# Altium project PoHalf.PrjPcb
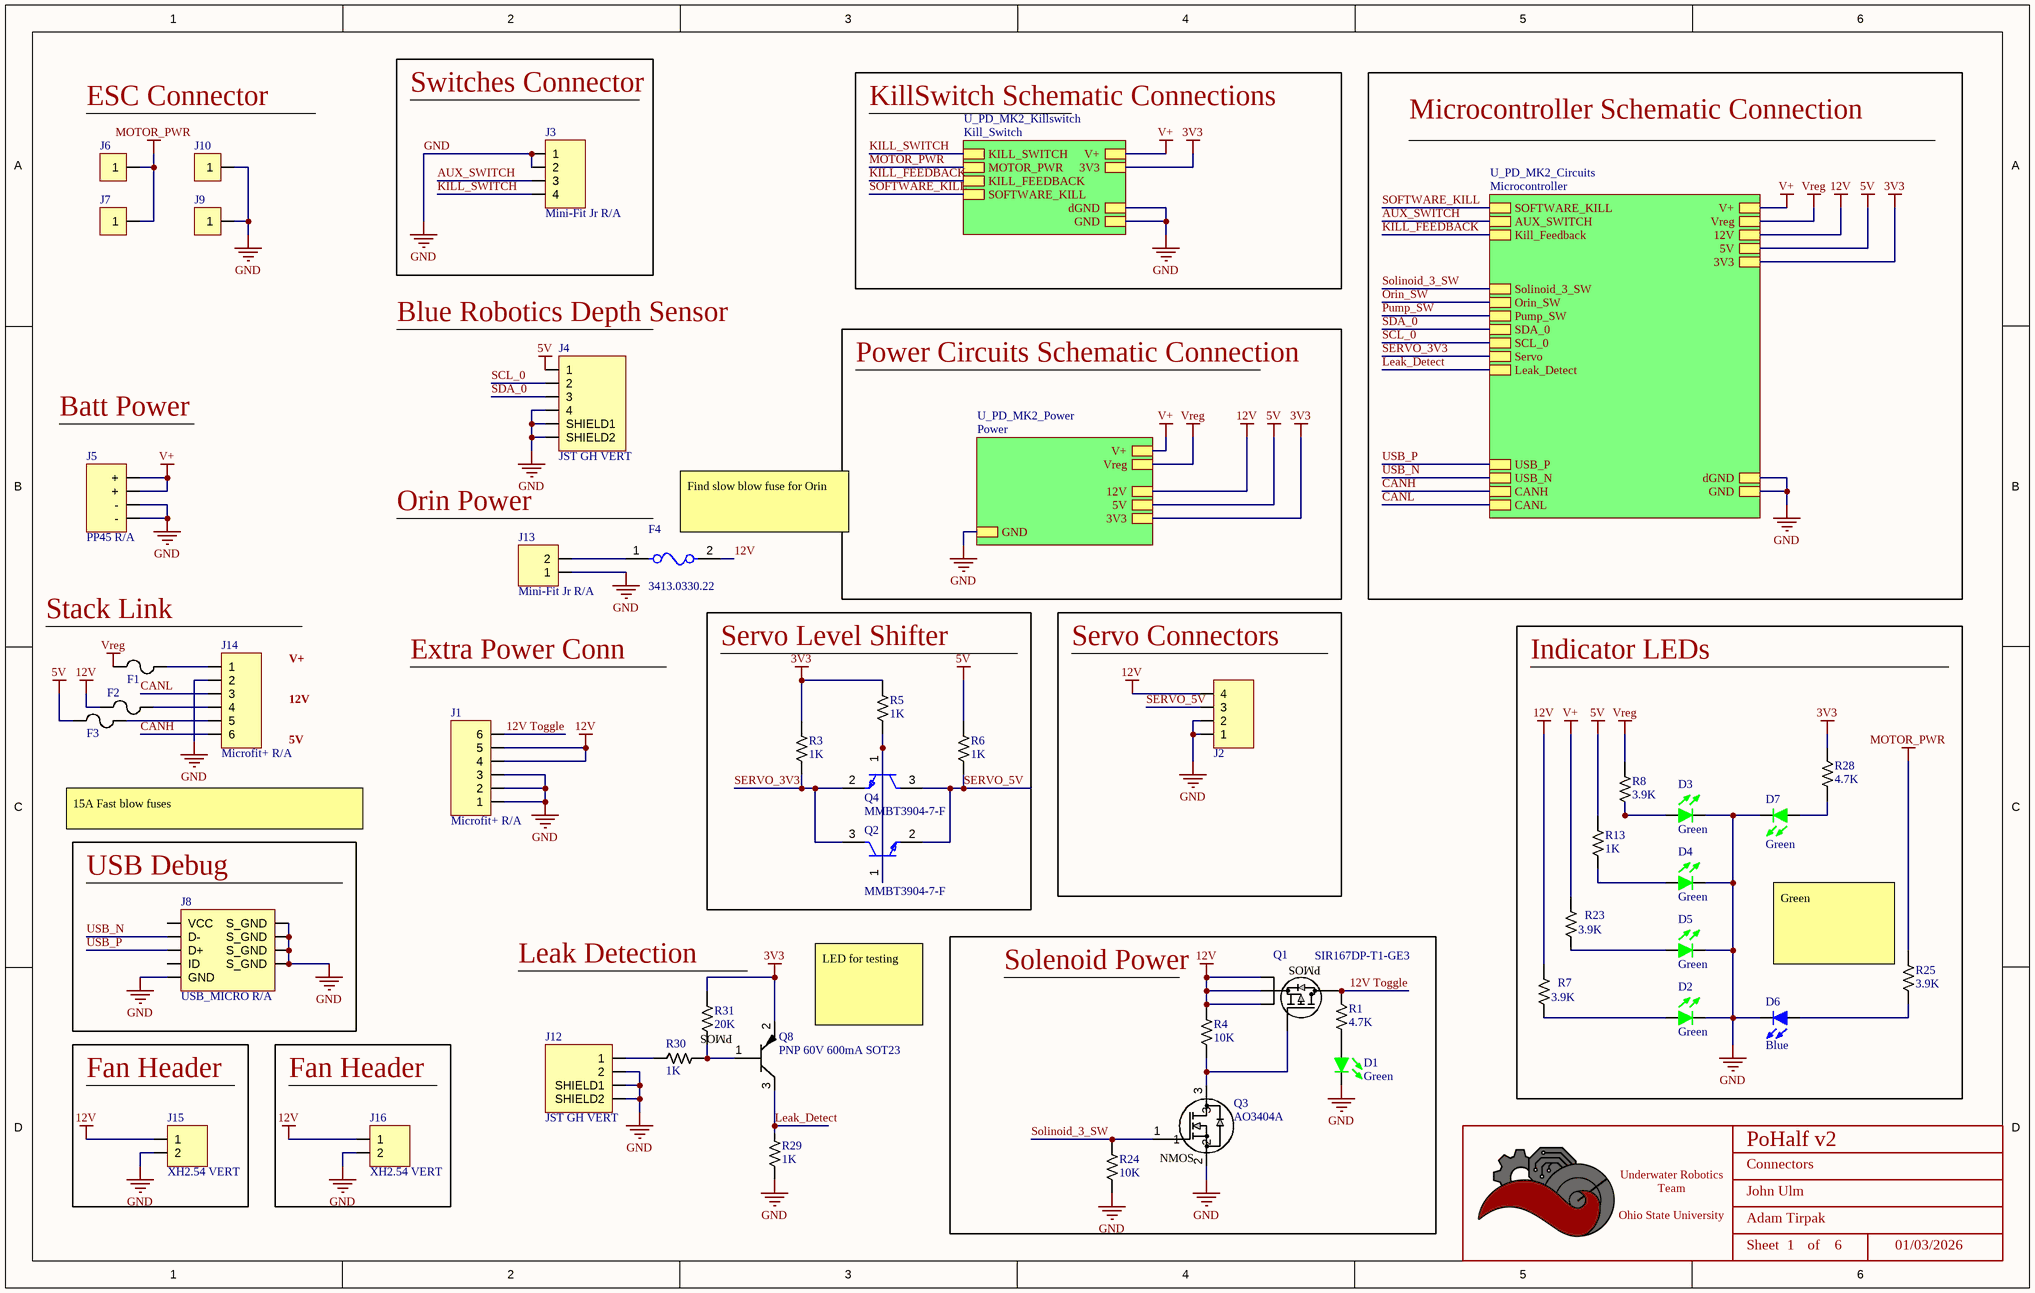
[diagram p0: Connector.SchDoc]
TeamLead: Adam Tirpak; ProjectTitle: PoHalf v2
4 sheets, 95 parts. Net scope: hierarchical (ports join the sheet entries above them; power ports are global).
Board file: PoHalf.PcbDoc
Sheets:
  Connector.SchDoc
    U_PD_MK2_Power = Power.SchDoc
    U_PD_MK2_Circuits = Microcontroller.SchDoc
    U_PD_MK2_Killswitch = Kill_Switch.SchDoc

## Sheet Connector.SchDoc: Connectors
size B; Date: 01/03/2026; Author: John Ulm; Organization: ORGANIZATION; Address1: ADDRESS 1; Address2: ADDRESS 2; Address3: ADDRESS 3; Address4: ADDRESS 4; Revision: -; SheetNumber: 1; SheetTotal: 6; ENG_APP_DATE: --/--/--; DSN_APP_DATE: --/--/--; CHK_APP_DATE: --/--/--

### Parts
(Parts that share a designator on the sheet are numbered #1, #2 ... from top to bottom, then left to right.)
*#1  Title_Block  [LOGO]  (value not drawn)  (graphical)
D1  Color: Green  [LED_0603]  (hidden comment: IN-S63AT5G)
D2  Color: Green  [LED_0603]  (hidden comment: IN-S63AT5G)
D3  Color: Green  [LED_0603]  (hidden comment: IN-S63AT5G)
D4  Color: Green  [LED_0603]  (hidden comment: IN-S63AT5G)
D5  Color: Green  [LED_0603]  (hidden comment: IN-S63AT5G)
D6  Color: Blue  [LED_0603]  (hidden comment: 150060BS75000)
D7  Color: Green  [LED_0603]  (hidden comment: IN-S63AT5G)
F1  0685H9150-01  [0501Series_LTF]  (value not drawn)
F2  0685H9150-01  [0501Series_LTF]  (value not drawn)
F3  0685H9150-01  [0501Series_LTF]  (value not drawn)
F4  3413.0330.22  [FP-3413_0330_22-MFG]
J1  Microfit+ R/A  [CONN_MOLEX_MICROFIT_6_POS_R/A]
J2  Microfit+ R/A  [CONN_MOLEX_MICROFIT_4_POS_R/A]  (value not drawn)
J3  Mini-Fit Jr R/A  [CONN_MOLEX_MINIFIT JR_4 POS_R/A]
J4  JST GH VERT  [CONN_JST_BM04B-GHS-TBT(LF)(SN)(N)]
J5  PP45 R/A  [CONN_ANDERSON_PP45_4 POS_R/A]
J6  Redcube M4 Term 85A  [Redcube M4 Term 85A]  (value not drawn)
J7  Redcube M4 Term 85A  [Redcube M4 Term 85A]  (value not drawn)
J8  USB_MICRO R/A  [CONN_MINIUSB]
J9  Redcube M4 Term 85A  [Redcube M4 Term 85A]  (value not drawn)
J10  Redcube M4 Term 85A  [Redcube M4 Term 85A]  (value not drawn)
J12  JST GH VERT  [CONN_JST_SM02B-GHS-TB(LF)(SN)]
J13  Mini-Fit Jr R/A  [CONN_MOLEX_MINIFIT JR_2 POS_R/A]
J14  Microfit+ R/A  [CONN_MOLEX_MICROFIT_6_POS_R/A]
J15  XH2.54 VERT  [CONN_JST_XH254_2POS_VERT]
J16  XH2.54 VERT  [CONN_JST_XH254_2POS_VERT]
Q1  SIR167DP-T1-GE3  [MOSFET_7DP-T1-GE3_VIS]
Q2  MMBT3904-7-F  [FP-SOT23-IPC_A]
Q3  AO3404A  [SOT-23-3]
Q4  MMBT3904-7-F  [FP-SOT23-IPC_A]
Q8  PNP 60V 600mA SOT23  [SOT-23-3]
R1  Value  (Ohms): 4.7K  [RESISTOR_0603]  (hidden comment: 4.7k Ohm 5% 1/10W)
R3  Value  (Ohms): 1K  [RESISTOR_0603]  (hidden comment: 1k Ohm 5% 1/8W)
R4  Value  (Ohms): 10K  [RESISTOR_0603]  (hidden comment: 10k Ohm 5% 1/10W)
R5  Value  (Ohms): 1K  [RESISTOR_0603]  (hidden comment: 1k Ohm 5% 1/8W)
R6  Value  (Ohms): 1K  [RESISTOR_0603]  (hidden comment: 1k Ohm 5% 1/8W)
R7  Value  (Ohms): 3.9K  [RESISTOR_0603]  (hidden comment: 3.9k Ohm 5% 1/10W)
R8  Value  (Ohms): 3.9K  [RESISTOR_0603]  (hidden comment: 3.9k Ohm 5% 1/10W)
R13  Value  (Ohms): 1K  [RESISTOR_0603]  (hidden comment: 1k Ohm 5% 1/8W)
R23  Value  (Ohms): 3.9K  [RESISTOR_0603]  (hidden comment: 3.9k Ohm 5% 1/10W)
R24  Value  (Ohms): 10K  [RESISTOR_0603]  (hidden comment: 10k Ohm 5% 1/10W)
R25  Value  (Ohms): 3.9K  [RESISTOR_0603]  (hidden comment: 3.9k Ohm 5% 1/10W)
R28  Value  (Ohms): 4.7K  [RESISTOR_0603]  (hidden comment: 4.7k Ohm 5% 1/10W)
R29  Value  (Ohms): 1K  [RESISTOR_0603]  (hidden comment: 1k Ohm 5% 1/8W)
R30  Value  (Ohms): 1K  [RESISTOR_0603]  (hidden comment: 1k Ohm 5% 1/8W)
R31  Value  (Ohms): 20K  [RESISTOR_0402]  (hidden comment: 20k Ohm 1% 1/16W)

### Blocks framed on the sheet
Switches Connector: J3
Servo Level Shifter: Q2 Q4 R3 R5 R6
Servo Connectors: J2
Indicator LEDs: D2-D7 R7 R8 R13 R23 R25 R28
USB Debug: J8
Solenoid Power: D1 Q1 Q3 R1 R4 R24
Fan Header: J15
Fan Header: J16

### Sub-sheets
U_PD_MK2_Circuits = Microcontroller: GND, V+, 5V, 3V3, SOFTWARE_KILL, AUX_SWITCH, 12V, dGND, Vreg, USB_P, USB_N, CANH, CANL, Kill_Feedback, Solinoid_3_SW, Orin_SW, SDA_0, SCL_0, Pump_SW, Servo, Leak_Detect
U_PD_MK2_Killswitch = Kill_Switch: KILL_SWITCH, MOTOR_PWR, V+, 3V3, dGND, GND, KILL_FEEDBACK, SOFTWARE_KILL
U_PD_MK2_Power = Power: GND, V+, 5V, 3V3, Vreg, 12V

### Nets
3V3: Q8.2 R3.1 R5.1 R28.2 R31.1 ; sheet U_PD_MK2_Power/3V3, sheet U_PD_MK2_Circuits/3V3, sheet U_PD_MK2_Killswitch/3V3
5V: F3.1 J4.1 R6.1 R13.1 ; sheet U_PD_MK2_Power/5V, sheet U_PD_MK2_Circuits/5V
12V: F2.1 F4.2 J1.4 J1.5 J2.4 J15.1 J16.1 Q1.1(S) Q1.2(S) Q1.3(S) R4.1 R7.1 ; sheet U_PD_MK2_Power/12V, sheet U_PD_MK2_Circuits/12V
GND: D1.2 D2.2 D3.2 D4.2 D5.2 D6.2 D7.2 J1.1 J1.2 J1.3 J2.1 J2.2 J3.1 J3.2 J4.4 J4.S1(SHIELD1) J4.S2(SHIELD2) J5.3(-) J5.4(-) J8.5(GND) J8.6(S_GND) J8.7(S_GND) J8.8(S_GND) J8.9(S_GND) J9.1 J10.1 J12.2 J12.S1(SHIELD1) J12.S2(SHIELD2) J13.1 J14.2 J15.2 J16.2 Q3.2 R24.2 R29.2 ; sheet U_PD_MK2_Power/GND, sheet U_PD_MK2_Circuits/GND, sheet U_PD_MK2_Circuits/dGND, sheet U_PD_MK2_Killswitch/dGND, sheet U_PD_MK2_Killswitch/GND
MOTOR_PWR: J6.1 J7.1 R25.1 ; sheet U_PD_MK2_Killswitch/MOTOR_PWR
V+: J5.1(+) J5.2(+) R23.1 ; sheet U_PD_MK2_Power/V+, sheet U_PD_MK2_Circuits/V+, sheet U_PD_MK2_Killswitch/V+
Vreg: F1.1 R8.1 ; sheet U_PD_MK2_Power/Vreg, sheet U_PD_MK2_Circuits/Vreg
12V Toggle: J1.6 Q1.D R1.2
AUX_SWITCH: J3.3 ; sheet U_PD_MK2_Circuits/AUX_SWITCH
CANH: J14.6 ; sheet U_PD_MK2_Circuits/CANH
CANL: J14.3 ; sheet U_PD_MK2_Circuits/CANL
KILL_FEEDBACK: sheet U_PD_MK2_Circuits/Kill_Feedback, sheet U_PD_MK2_Killswitch/KILL_FEEDBACK
KILL_SWITCH: J3.4 ; sheet U_PD_MK2_Killswitch/KILL_SWITCH
Leak_Detect: Q8.3 R29.1 ; sheet U_PD_MK2_Circuits/Leak_Detect
Orin_SW: sheet U_PD_MK2_Circuits/Orin_SW
Pump_SW: sheet U_PD_MK2_Circuits/Pump_SW
SCL_0: J4.2 ; sheet U_PD_MK2_Circuits/SCL_0
SDA_0: J4.3 ; sheet U_PD_MK2_Circuits/SDA_0
SERVO_3V3: Q2.3(C) Q4.2(E) R3.2 ; sheet U_PD_MK2_Circuits/Servo  [project net Servo]
SERVO_5V: J2.3 Q2.2(E) Q4.3(C) R6.2
SOFTWARE_KILL: sheet U_PD_MK2_Circuits/SOFTWARE_KILL, sheet U_PD_MK2_Killswitch/SOFTWARE_KILL
Solinoid_3_SW: Q3.1 R24.1 ; sheet U_PD_MK2_Circuits/Solinoid_3_SW
USB_N: J8.2(D-) ; sheet U_PD_MK2_Circuits/USB_N
USB_P: J8.3(D+) ; sheet U_PD_MK2_Circuits/USB_P
NetD1_1: D1.1 R1.1
NetD2_1: D2.1 R7.2
NetD3_1: D3.1 R8.2
NetD4_1: D4.1 R13.2
NetD5_1: D5.1 R23.2
NetD6_1: D6.1 R25.2
NetD7_1: D7.1 R28.1
NetF1_2: F1.2 J14.1
NetF2_2: F2.2 J14.4
NetF3_2: F3.2 J14.5
NetF4_1: F4.1 J13.2
NetJ12_1: J12.1 R30.2
NetQ1_4: Q1.4(G) Q3.3 R4.2
NetQ2_1: Q2.1(B) Q4.1(B) R5.2
NetQ8_1: Q8.1 R30.1 R31.2

Not connected (* = marked no-connect by the designer): J8 1(VCC) 4(ID)

### Notes on the sheet
- ESC Connector
- KillSwitch Schematic Connections
- Microcontroller Schematic Connection
- (near J4) Blue Robotics Depth Sensor
- Power Circuits Schematic Connection
- Batt Power
- Orin Power
- (near F4) Find slow blow fuse for Orin
- Stack Link
- V+
- 12V
- Extra Power Conn
- 5V
- 15A Fast blow fuses
- (near R31) Leak Detection
- (near R25) Green
- (near Q8) LED for testing
- DWG. NO.
- REV.
- SHT.
- THIS DOCUMENT AND THE DATA DISCLOSED HEREIN OR HEREWITH IS THE PROPERTY OF ALTIUM LIMITED AND MAY BE FREELY DISTRIBUTED IN WHOLE. NO RIGHTS ARE RESERVED OR EXPRESS OR IMPLIED WARANTEE GIVEN.
- REVISION
- DESCRIPTION
- DATE
- APPROVED
- ENG:
- APPROVALS
- PROJECT
- DSN:
- CHK:
- REFERENCE DOCUMENTS
- PROJECT REVISION:
- TITLE
- DOCUMENT REVISION:
- DESIGN ITEM:
- BOM:
- FAB DWG:
- PCB DWG:
- ASSY DWG:
- SCALE:
- SIZE
- B
- CAGE CODE
- FILE NAME
- DWG NO.
- SHEET
- OF
- REV
- (in symbol AO3404A) NMOS
- (in symbol MMBT2907A-7-F) PMOS
- (in symbol SIR167DP-T1-GE3) PMOS
- (in symbol Title_Block) Underwater Robotics Team / Ohio State University; Sheet; of

### Library data of the parts
*#1 = Title_Block: UWRT Schematic Title Block Template / Created June 2021, Dylan Trainor
D1-D5 D7 = LED_Green_0603_3V: LED Green Vf= 3V If = 0.005A / IN-S63AT5G; Made By: Robert Pafford; Forward Current: 5mA; ComponentLink1Description: Datasheet; ComponentLink1URL: https://www.we-online.de/katalog/datasheet/150060GS75000.pdf; Forward Voltage: 3V; Package: 0603; Supplier 1: Digi-Key; Supplier Part Number 1: 1830-1062-1-ND
D6 = LED_Blue_0603: LED Blue Vf= 3.2V If = 0.020A / 150060BS75000; Made By: Robert Pafford; Forward Current: 20mA; Forward Voltage: 3.2V; Package: 0603; Supplier 1: Digi-Key; Supplier Part Number 1: 732-4966-1-ND
F1-F3 = Bel Fuse 15A: Bel Fuse  | 15A | 32V DC | SMD | Fast Blow | 1206; Current Rating: 15; Breaking Capacity: 150A; Mfr_Name: Bel Fuse; Manufacturer_Part_Number: 0685H9150-01; Voltage Rating: 32V; Response Time: Fast Blow; Package: 1206; Created By: Nathan Ayer
F4 = CMP-26293-000001-1: FUSE BOARD MNT 15A 32VAC 63VDC; Manufacturer: Schurter Inc; Max Fuse Ac Voltage: 32V; Fuse Voltage Drop: 57mV; Value: 3.5mΩ; Voltage Rating: 63V; Fuse Blow Speed: Slow; Fuse Interrupt Dc Current: 100A; Fuse I2T: 65A2Sec; Automotive: No; Ambient Temperature Range High: +90°C; RoHS: TRUE; Digikey Description: FUSE BOARD MNT 15A 32VAC 63VDC; Height: 0.6mm; Manufacturer Part Number: 3413.0330.22; Mouser Description: Surface Mount Fuses UST 1206 FUSE 15A F; Device Class L1: Circuit Protection; Ipc Land Pattern Name: CAPC320160X60; ComponentLink2URL: https://us.schurter.com/en/datasheet/typ_UST_1206.pdf; Resistance: 3.5mΩ; ComponentLink2Description: Datasheet; Octopart: https://octopart.com/3413.0330.22-schurter-8400836; Max Fuse Dc Voltage: 63V; Fuse Current: 15A; Category: Fuse; Device Class L3: unset; Package: 0; Ambient Temperature Range Low: -55°C; Device Class L2: Fuses; Lead Free: Yes
J1 J14 = CONN_MOLEX_MICROFIT+_6POS_R/A: Molex Microfit+ / 212528 6 POS R/A Black; Pitch: 3.0mm; Current Per Pin: 12.5; Supplier 1: Digikey; Supplier Part Number 1: 900-2125280600-ND; Manufacturer: Molex; Configuration: R/A; Color: Black
J2 = CONN_MOLEX_MICROFIT+_4POS_R/A: Molex Microfit+ / 212528 4 POS R/A Black; Pitch: 3.0mm; Current Per Pin: 12.5A; Manufacturer: Molex; Supplier 1: Digikey; Supplier Part Number 1: 900-2125280400-ND; Configuration: R/A; Color: Black
J3 = CONN_MOLEX_MINIFIT JR_4POS_R/A: Molex Minifit Jr. 5569 / 4 Pos R/A Natural; Pitch: 4.2mm; Configuration: Right Angle; Current Per Pin: 13A; Number of Positions: 4; Supplier Part Number 1: WM13112-ND; Supplier 1: Digi-Key; Manufacturer: Molex; Color: Natural; Created By: Flip B; ComponentLink1Description: Datasheet; ComponentLink1URL: https://www.molex.com/pdm_docs/sd/026013115_sd.pdf; Series: Minifit Jr 5569
J4 = CONN_JST_GH_4POS_VERT: JST GH Pitch 4 Pos Vertical; Pitch: 1.25mm; Current Per Pin: 1A; Number of Positions: 4; Manufacturer: JST; Configuration: Vertical; Color: Natural; Created By: Robert P; Series: GH; Supplier 1: Digi-Key; Supplier Part Number 1: 455-1580-1-ND
J5 = CONN_ANDERSON_2x2_R/A: Anderson PP45 / 4 Pos R/A Red/Black; Pitch: 7.9mm; Configuration: Right Angle; Current Per Pin: 45A; Number of Positions: 4; Manufacturer: Anderson; Color: Red/Black; Created By: Flip B; ComponentLink1Description: Datasheet; ComponentLink1URL: https://www.andersonpower.com/content/dam/app/ecommerce/product-pdfs/DS-PP1545.pdf; Series: PowerPole 45; Supplier 1: Digi-Key; Supplier Part Number 1: 2243-1337G1-ND; Supplier 2: Digi-Key; Supplier Part Number 2: 2243-1336G1-ND; Supplier 3: Digi-Key; Supplier Part Number 3: 2243-1327-BK-ND; Supplier 4: Digi-Key; Supplier Part Number 4: A102007-ND
J8 = CONN_MICROUSB: Amphenol Micro USB-B / USB2.0 5 Pin Right Angle SMD; Pitch: 0.65mm; Current Per Pin: 1.8A; Number of Positions: 5; Manufacturer: Amphenol; Configuration: Right Angle; Color: Silver; Created By: Flip B; ComponentLink1Description: Datasheet; ComponentLink1URL: https://cdn.amphenol-icc.com/media/wysiwyg/files/documentation/datasheet/inputoutput/io_usb_micro.pdf?__cf_chl_jschl_tk__=05693735e19256298f6ef6ca2bb2e65c376a4f56-1625503833-0-Abitsb0-ufjOXJYs_S3J3r2iTn-nObalbmXUksF1VvO_h_WEmRdMlUD1I8-hmWSEVWzY1pirKnrPZWfgY3851qyBZe5ZvnNQePLGIzUgdEIQBVUyW36RsbYpDLEWxJ4horD-5gChFgobLYqwmG5aHl0E8lIn_twwPPrOxilK2gP0q9t_CNOs_u5fMqXvXUrlsOv8tIE2NRlu6NVP8qtkL2GjhlkeTUbDMF8WvvpPDTFOgvZ4Y16Ej8F8AhWos88mo5B1HssXozw0XrkJQIqERITUu6rqloz9kf4ZzhBHtDAt-IkiAFY_Ds9SW8FYKKTtINJVpHZQ6Gyu1FFM4Dc9MO0maE8_mmNcwlxqyRoRk_MPWW8VyByXWM5RSp52jteRKw7FeI9WIYvCbPAOy0Eyib-aseIQsnGbglBcUY6_2xp8GYaJM38H3dNvBPsSOfJBPndKedwKHllxjkucXn6xsN0sDXkpGN-cu8_2bDTJ0g-uUucKSCooYX-ApSDNGpkA_p9zv1SOAD8c0zaZVmtiBsN75QpVz2rzq9_BFxOywPvR; Series: 10118192; Supplier 1: Digi-Key; Supplier Part Number 1: 609-4613-1-ND
J12 = CONN_JST_GH_2POS_VERT: JST GH Pitch 2 Pos Vertical; Pitch: 1.25mm; Current Per Pin: 1A; Number of Positions: 4; Manufacturer: JST; Configuration: Vertical; Color: Natural; Created By: Robert P; Series: GH; Supplier 1: Digi-Key; Supplier Part Number 1: 455-1564-1-ND
J13 = CONN_MOLEX_MINIFIT JR_2POS_R/A: Molex Minifit Jr. 5569 / 2 Pos R/A Natural; Pitch: 4.2mm; Configuration: Right Angle; Current Per Pin: 13A; Number of Positions: 2; Manufacturer: Molex; Color: Natural; Created By: Robert P; ComponentLink1Description: Datasheet; ComponentLink1URL: https://www.molex.com/pdm_docs/sd/026013115_sd.pdf; Series: Minifit Jr 5569; Supplier 1: Digi-Key; Supplier Part Number 1: WM1351-ND
J15 J16 = CONN_JST_XH254_2POS_VERT: JST XH 2.54mm Pitch 2 Pos Vertical; Current Per Pin: 4A; Number of Positions: 2; NOTE: Do not use JST 2.5mm parts with this footprint. JST does not make 2.54mm pitch pins, rather only clones make this connector!; Manufacturer: JST; Pitch: 2.54mm; Configuration: Vertical; Color: White; Created By: Robert P; Series: XH 2.54; ComponentLink1Description: Purchase Link; ComponentLink1URL: https://www.amazon.com/460PCS-XH2-54-Connector-Terminal-Connectors/dp/B09DBGVX5C
Q1 = SIR167DP-T1-GE3: P-Channel 30 V 60A (Tc) 65.8W (Tc) Surface Mount PowerPAK® SO-8; Mfr_Name: Vishay; Type: DEV; Copyright: Copyright (C) 2022 Ultra Librarian. All rights reserved.; Manufacturer_Part_Number: SIR167DP-T1-GE3; RefDes: RefDes; Supplier 1: Mouser; Supplier Part Number 1: 78-SIR167DP-T1-GE3
Q2 Q4 = CMP-2000-04931-2: TRANS NPN 40V 0.2A SMD SOT23-3; Frequency: 300MHz; Power Dissipation: 350mW; Element Configuration: Single; Max Power Dissipation: 300mW; Max Collector Current: 200mA; Collector Emitter Saturation Voltage: 300mV; Number of Elements: 1; hFE Min: 100; Collector Base Voltage (VCBO): 60V; Emitter Base Voltage (VEBO): 6V; Contact Plating: Tin; Package Quantity: 3000; Max Frequency: 300MHz; REACH SVHC: No SVHC; Max Operating Temperature: 150°C; Width: 1.4mm; Collector Emitter Voltage (VCEO): 40V; Voltage Rating (DC): 40V; Radiation Hardening: No; Case/Package: SOT-23; Height: 1mm; Collector Emitter Breakdown Voltage: 40V; Length: 3.05mm; Polarity: NPN; Packaging: Tape and Reel; Number of Pins: 3; Min Operating Temperature: -55°C; Gain Bandwidth Product: 300MHz; Mount: Surface Mount; Weight: 0.000282oz; Continuous Collector Current: 200mA; Transition Frequency: 300MHz; Max Breakdown Voltage: 40V; Lead Free: Lead Free
Q3 = AO3404A: N-Channel 30 V 5.8A (Ta) 1.4W (Ta) Surface Mount SOT-23-3; Vendor: Alpha & Omega Semiconductor Inc.; SourceLibrary: ON_Semiconductor_2020-01-13; Vgs (Max): 3V @ 5.8A, 10V; Vgs (th): 3V @ 250µA; Vdss: 30V; Rds (on): 28mOhm @ 5.8A, 10V; Amp Rating: 5.8 A; FET Type: N-Channel; Package: SOT23-3L; Manufacturer _Part_Number: AO3404A; Power Dissipation: 1.4W (Ta); Supplier 1: Digi-Key; Supplier Part Number 1: 785-1004-1-ND; Created By: Dylan T
Q8 = MMBT2907A-7-F: PNP 60 V 600mA Surface Mount SOT-23; Vendor: Digikey; Vgs (Max): ±10V; Vgs (th): 800mV @ 250µA; Vdss: 20 V; Power Dissipation: 1.56W (Tc); Rds (on): 50mOhm @ 3A, 4.5V; Amp Rating: 600mA; BJT Type: PNP; Package: TO-236-3, SC-59, SOT-23-3; Manufacturer_Part_Number: MMBT2907A-7-F; Created By: Robert Pafford; ComponentLink1Description: Datasheet; ComponentLink1URL: https://media.digikey.com/pdf/Data%20Sheets/Diodes%20PDFs/MMBT2907A_Rev2016.pdf; Supplier 1: Digi-Key; Supplier Part Number 1: MMBT2907A-FDICT-ND
R1 R28 = RESISTOR_4.7K_0603: RES 4.7k OHM 5% 1/10W 0603; Tolerance: +/- 5%; Made By: Robert Pafford; Wattage: 1/10W; Supplier: Digikey; Digikey Part Numer: CR0603-JW-104ELFTR-ND; Supplier 1: Digi-Key; Supplier Part Number 1: RMCF0603JT4K70CT-ND
R3 R5 R6 R13 R29 R30 = RESISTOR_1K_0603: RES 1k OHM 5% 1/8W 0603; Tolerance: +/- 5%; Made By: Robert Pafford; ComponentLink1Description: Datasheet; ComponentLink1URL: https://www.bourns.com/docs/product-datasheets/CRxxxxx.pdf; Wattage: 1/8W; Supplier: Digikey; Digikey Part Numer: CR0603-JW-104ELFTR-ND; Supplier 1: Digi-Key; Supplier Part Number 1: 2019-RK73B1JTTD102JCT-ND
R4 R24 = RESISTOR_10K_0603: RES 10k OHM 5% 1/10W 0603; Tolerance: +/- 5%; Wattage: 1/8W; Made By: Robert Pafford; ComponentLink1Description: Datasheet; ComponentLink1URL: https://www.bourns.com/docs/product-datasheets/CRxxxxx.pdf; Supplier: Digikey; Digikey Part Numer: CR0603-JW-104ELFTR-ND; Supplier 1: Digi-Key; Supplier Part Number 1: 2019-RK73B1JTTD103JCT-ND
R7 R8 R23 R25 = RESISTOR_3.9K_0603: RES 3.9k OHM 1% 1/10W 0603; Tolerance: +/- 1%; Made By: Robert Pafford; Wattage: 1/10W; Supplier 1: Digi-Key; Supplier Part Number 1: P3.90KHCT-ND
R31 = RESISTOR_20K_0402: RES 20k OHM 1% 1/16W 0402; Tolerance: +/- 1%; Made By: Robert Pafford; Wattage: 1/16W; Supplier 1: Digikey; Supplier Part Number 1: YAG3454CT-ND
J6 J7 J9 J10 = Redcube M4 Term 85A: Created By: Nahtan Ayer; Current Rating: 85 A; Screw Size: M4

## Sheet Power.SchDoc: Power
size B; Date: 01/03/2026; Author: John Ulm; Organization: ORGANIZATION; Address1: ADDRESS 1; Address2: ADDRESS 2; Address3: ADDRESS 3; Address4: ADDRESS 4; Revision: -; SheetNumber: 4; SheetTotal: 6; ENG_APP_DATE: --/--/--; DSN_APP_DATE: --/--/--; CHK_APP_DATE: --/--/--
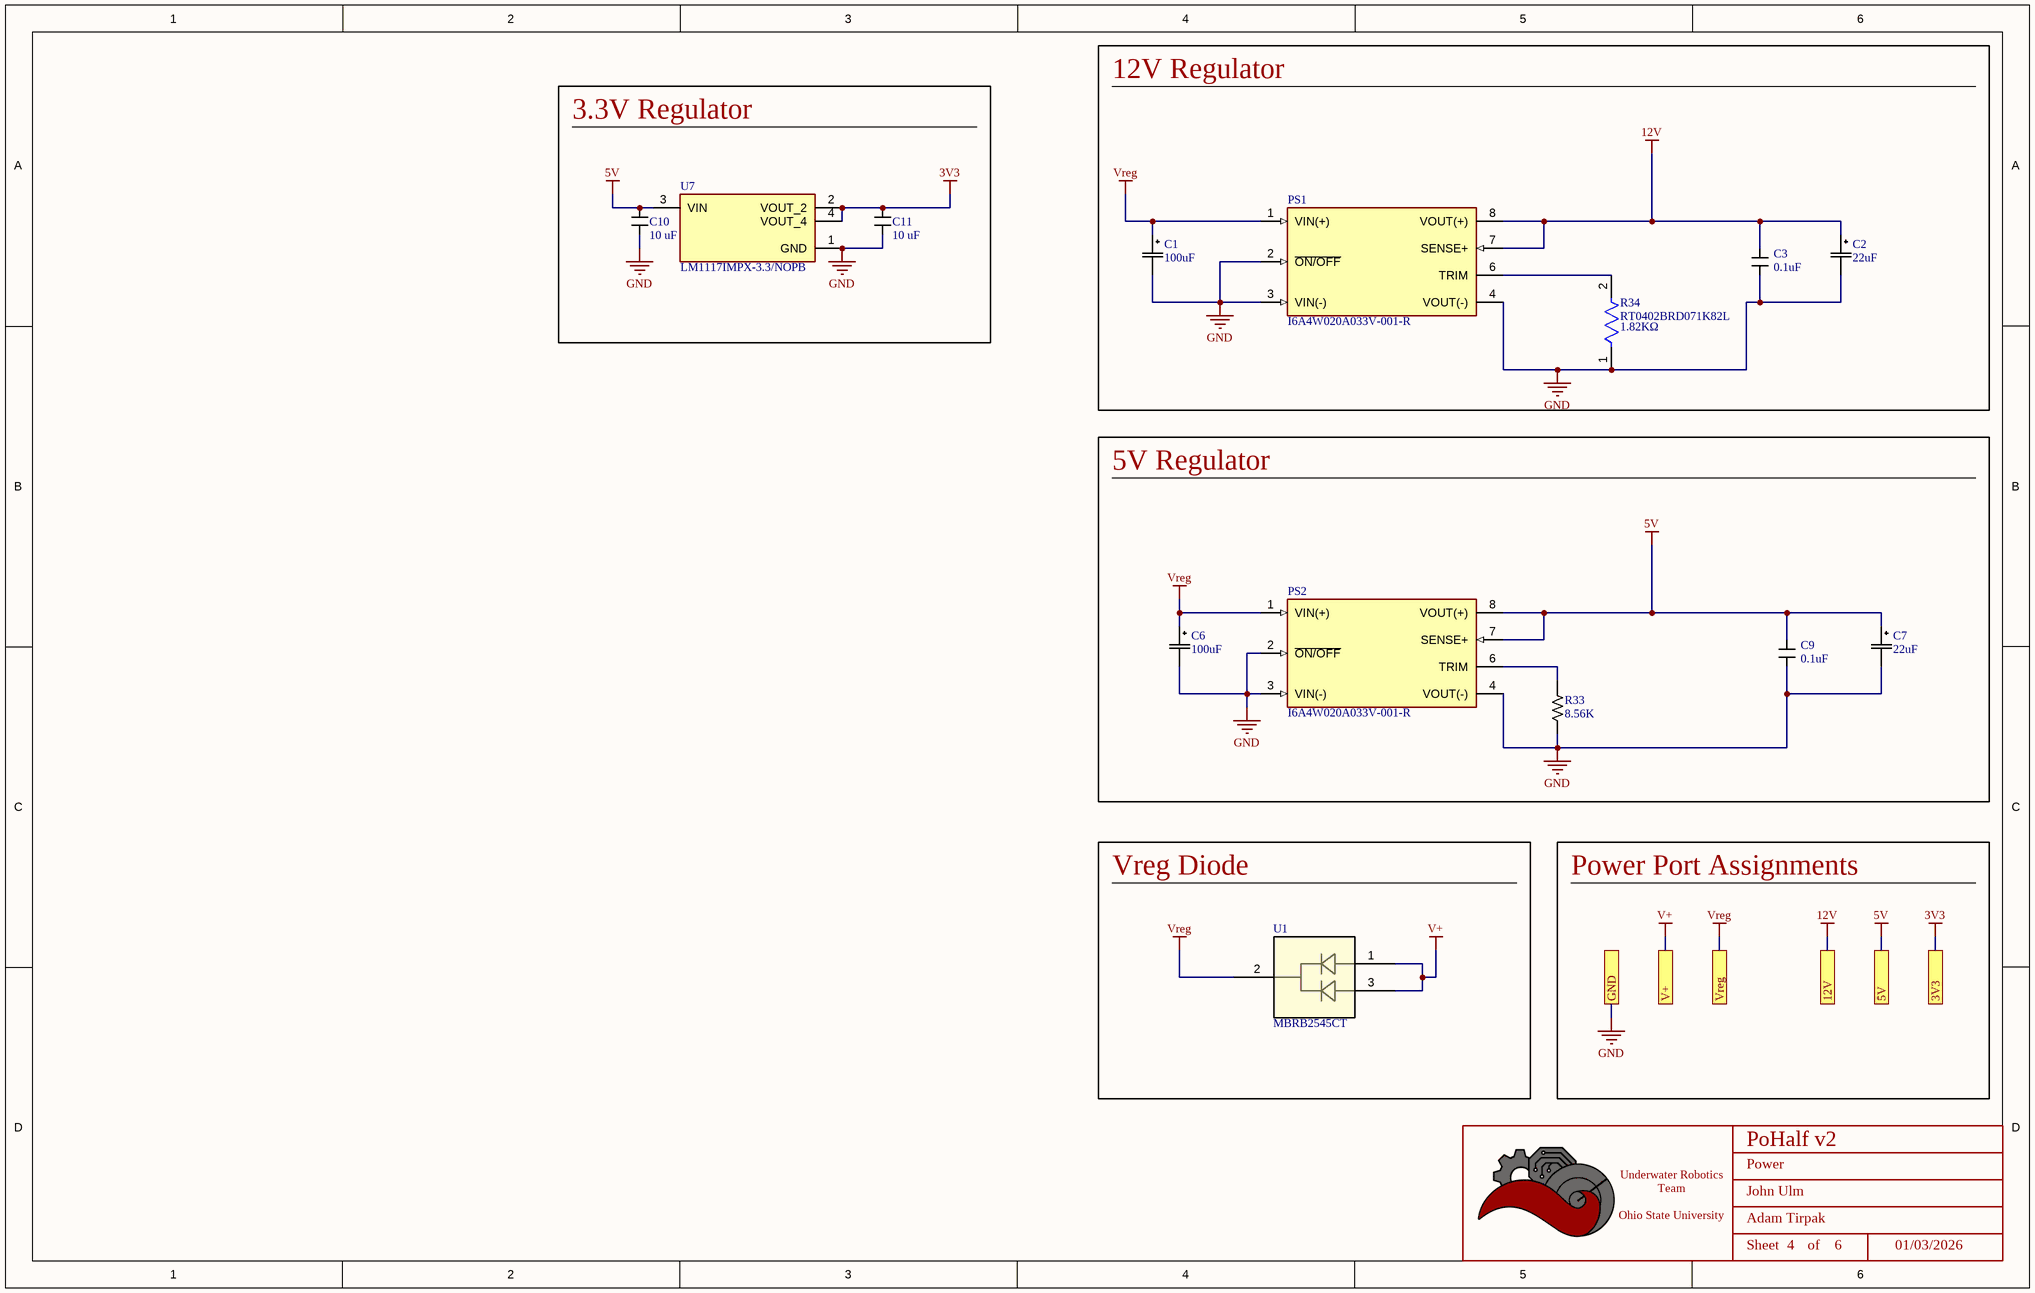
[diagram p1: Power.SchDoc]

### Parts
(Parts that share a designator on the sheet are numbered #1, #2 ... from top to bottom, then left to right.)
*#2  Title_Block  [LOGO]  (value not drawn)  (graphical)
C1  value 100uF  [PCAP_8x5.4-ELECT_NCA]  (hidden comment: 100uF electrolytic 35 V)
C2  value 22uF  [PCAP_8x5.4-ELECT_NCA]  (hidden comment: 22uF electrolytic 35 V)
C3  Capacitance: 0.1uF  [CAPACITOR_0402]  (hidden comment: CL05A104KA5NNNC)
C6  value 100uF  [PCAP_8x5.4-ELECT_NCA]  (hidden comment: 100uF electrolytic 35 V)
C7  value 22uF  [PCAP_8x5.4-ELECT_NCA]  (hidden comment: 22uF electrolytic 35 V)
C9  Capacitance: 0.1uF  [CAPACITOR_0402]  (hidden comment: CL05A104KA5NNNC)
C10  Value (uF): 10 uF  [CAPACITOR_0603]  (hidden comment: 10uF Ceramic 6.3V)
C11  Value (uF): 10 uF  [CAPACITOR_0603]  (hidden comment: 10uF Ceramic 6.3V)
PS1  I6A4W020A033V-001-R  [CONV_I6A4W020A033V-001-R]
PS2  I6A4W020A033V-001-R  [CONV_I6A4W020A033V-001-R]
R33  Value (Ohms): 8.56K  [RESISTOR_0402]  (hidden comment: RES 8.56K OHM 1% 1/16W 0402)
R34  RT0402BRD071K82L  Resistance: 1.82KΩ  [FP-RT0402-MFG]
U1  MBRB2545CT  [D2PAK_VIS]
U7  LM1117IMPX-3.3/NOPB  [SOT-223-4]

### Blocks framed on the sheet
12V Regulator: C1-C3 PS1 R34
3.3V Regulator: C10 C11 U7
5V Regulator: C6 C7 C9 PS2 R33
Vreg Diode: U1

### Ports
3V3, 5V, 12V, GND, V+, Vreg

### Nets
3V3: C11.1 U7.2(VOUT_2) U7.4(VOUT_4) ; port 3V3
5V: C7.1 C9.1 C10.1 PS2.7(SENSE+) PS2.8(VOUT(+)) U7.3(VIN) ; port 5V
12V: C2.1 C3.1 PS1.7(SENSE+) PS1.8(VOUT(+)) ; port 12V
GND: C1.2 C2.2 C3.2 C6.2 C7.2 C9.2 C10.2 C11.2 PS1.2(~{ON/OFF}) PS1.3(VIN(-)) PS1.4(VOUT(-)) PS2.2(~{ON/OFF}) PS2.3(VIN(-)) PS2.4(VOUT(-)) R33.2 R34.1 U7.1(GND) ; port GND
V+: U1.1 U1.3 ; port V+
Vreg: C1.1 C6.1 PS1.1(VIN(+)) PS2.1(VIN(+)) U1.2 ; port Vreg
NetPS1_6: PS1.6(TRIM) R34.2
NetPS2_6: PS2.6(TRIM) R33.1

### Notes on the sheet
- Power Port Assignments
- DWG. NO.
- REV.
- SHT.
- THIS DOCUMENT AND THE DATA DISCLOSED HEREIN OR HEREWITH IS THE PROPERTY OF ALTIUM LIMITED AND MAY BE FREELY DISTRIBUTED IN WHOLE. NO RIGHTS ARE RESERVED OR EXPRESS OR IMPLIED WARANTEE GIVEN.
- REVISION
- DESCRIPTION
- DATE
- APPROVED
- ENG:
- APPROVALS
- PROJECT
- DSN:
- CHK:
- REFERENCE DOCUMENTS
- PROJECT REVISION:
- TITLE
- DOCUMENT REVISION:
- DESIGN ITEM:
- BOM:
- FAB DWG:
- PCB DWG:
- ASSY DWG:
- SCALE:
- SIZE
- B
- CAGE CODE
- FILE NAME
- DWG NO.
- SHEET
- OF
- REV
- (in symbol Title_Block) Underwater Robotics Team / Ohio State University; Sheet; of

### Library data of the parts
*#2 = Title_Block: as *#1 on sheet Connector
C1 C6 = CAP ALUM 100UF 20% 35V SMD: 100 µF 35 V Aluminum Electrolytic Capacitors Radial, Can - SMD 1000 Hrs; Mfr_Name: Nichicon; Manufacturer_Part_Number: UCB1V0R1MCL1GS; Type: DEV; Made by: Tyson Nguyen; Copyright: Copyright (C) 2022 Ultra Librarian. All rights reserved.; RefDes: RefDes; Supplier 1: Mouser; Supplier Part Number 1: 667-EEE-1VA101XP
C2 C7 = CAP ALUM 22UF 20% 35V SMD: 22 µF 35 V Aluminum Electrolytic Capacitors Radial, Can - SMD 1000 Hrs; Made by: Robert Pafford; Voltage: 35V; Supplier 1: Digi-Key; Supplier Part Number 1: PCE3952DKR-ND
C3 C9 = CAP CER 0.1UF 25V X5R 0402: 0.1 µF ±10% 25V Ceramic Capacitor X5R 0402 (1005 Metric); Name: Zach Ramsey; Tolerance: +/- 10%; ComponentLink1Description: Data Sheet; ComponentLink1URL: https://mm.digikey.com/Volume0/opasdata/d220001/medias/docus/503/CL05A104KA5NNNC.pdf; Rated Voltage: 25V
  C3: Supplier 1: Digikey; Supplier Part Number 1: 1276-1043-1-ND
  C9: Supplier 1: Avnet; Supplier Part Number 1: CL05A104KA5NNNC
C10 C11 = CAPACITOR_10uF_0603: Cap 10uF 6.3V +/-20% / Ceramic 0603; Made By: Flip B; ComponentLink1Description: Digikey; ComponentLink1URL: https://www.digikey.com/en/products/detail/samsung-electro-mechanics/CL10A106MQ8NNNC/3886777; Supplier 1: Digi-Key; Supplier Part Number 1: 1276-1119-1-ND; Tolerance: +/- 20%; Voltage: 6.3V
PS1 PS2 = I6A4W020A033V-001-R: Non-Isolated PoL Module DC DC Converter 1 Output 3.3 ~ 15V 20A 9V - 53V Input; MF: TDK-Lambda Americas; Availability: In Stock; Price: None; Package: DIP-8 TDK-Lambda; MP: I6A4W020A033V-001-R; Value: *; SnapEDA_Link: https://www.snapeda.com/parts/I6A4W020A033V-001-R/TDK-Lambda%20Americas%20Inc./view-part/1737324/?ref=snap; Check_prices: https://www.snapeda.com/parts/I6A4W020A033V-001-R/TDK-Lambda%20Americas%20Inc./view-part/1737324/?ref=eda; Purchase-URL: https://pricing.snapeda.com/search/part/I6A4W020A033V-001-R/?ref=eda
R33 = RESISTOR_8.56K_1%_0402: 8.56 kOhms ±1% 0.063W, 1/16W Chip Resistor 0402 (1005 Metric) Automotive AEC-Q200, Moisture Resistant Metal Film; Tolerance: +/- 1%; Made By: John Ulm; Supplier 1: Digi-Key; Supplier Part Number 1: 2019-RN73H1ETTP8561F50CT-ND; Wattage: 1/16W; Verified By: *
R34 = CMP-03412-030148-1: RES SMD 1.82K OHM 0.1% 1/16W; Manufacturer: Yageo; Tolerance: 0.001; Voltage Rating: 50V; Power Rating: 0.063W; Temperature Coefficient: 25 ppm/°C; Value: 1.82KΩ; Ipc Land Pattern Name: RESC10050X30; Package: RT0402; Automotive: No; Octopart: https://octopart.com/rt0402brd071k82l-yageo-1433757; ComponentLink2URL: http://www.yageo.com/documents/recent/PYu-RT_1-to-0.01_RoHS_L_9.pdf; Mouser Description: Thin Film Resistors 1/16W 1.82K ohm .1% 25ppm; Lead Free: Yes; Composition: Thin Film; Device Class L1: Passive Components; ComponentLink2Description: Datasheet; Series: RT; Footprint Url: http://www.yageo.com/exep/pages/download/literatures/PYu-R_Mount_10.pdf; Temperature Range Low: -55°C; Height: 0.35mm; Digikey Description: RES SMD 1.82K OHM 0.1% 1/16W; Device Class L2: Resistors; Device Class L3: Chip SMD Resistors; Category: Res; Manufacturer Part Number: RT0402BRD071K82L; RoHS: TRUE; Temperature Range High: +155°C; Temperature: -55°C to +155°C
U1 = MBRB2545CT: Diode Array 1 Pair Common Cathode 45 V Surface Mount TO-263-3, D²Pak (2 Leads + Tab), TO-263AB; Mfr_Name: Vishay; Copyright: Copyright (C) 2023 Ultra Librarian. All rights reserved.; Manufacturer_Part_Number: MBRB2545CT; RefDes: RefDes; Type: DEV; ComponentLink1Description: Supplier Link; ComponentLink1URL: https://www.digikey.com/en/products/detail/smc-diode-solutions/MBRB2545CT/6022901
U7 = LM1117IMPX-3.3/NOPB: 800-mA 15-V linear voltage regulator 4-SOT-223 -40 to 125; MF: Texas Instruments; Texas_Instruments-Purchase-URL: https://snapeda.com/shop?store=Texas+Instruments&id=410186; Price: None; Mouser-Purchase-URL: https://snapeda.com/shop?store=Mouser&id=410186; MP: LM1117IMPX-3.3/NOPB; Value: *; Availability: Good; Package: SOT-223-4 Texas Instruments; Arrow_Electronics-Purchase-URL: https://snapeda.com/shop?store=Arrow+Electronics&id=410186; SnapEDA_Link: https://www.snapeda.com/parts/LM1117IMPX-3.3/NOPB/Texas%20Instruments/view-part/410186/?ref=snap; DigiKey-Purchase-URL: https://snapeda.com/shop?store=DigiKey&id=410186

## Sheet Microcontroller.SchDoc: Microcontroller
size B; Date: 01/03/2026; Author: John Ulm; Organization: ORGANIZATION; Address1: ADDRESS 1; Address2: ADDRESS 2; Address3: ADDRESS 3; Address4: ADDRESS 4; Revision: -; SheetNumber: 3; SheetTotal: 6; ENG_APP_DATE: --/--/--; DSN_APP_DATE: --/--/--; CHK_APP_DATE: --/--/--
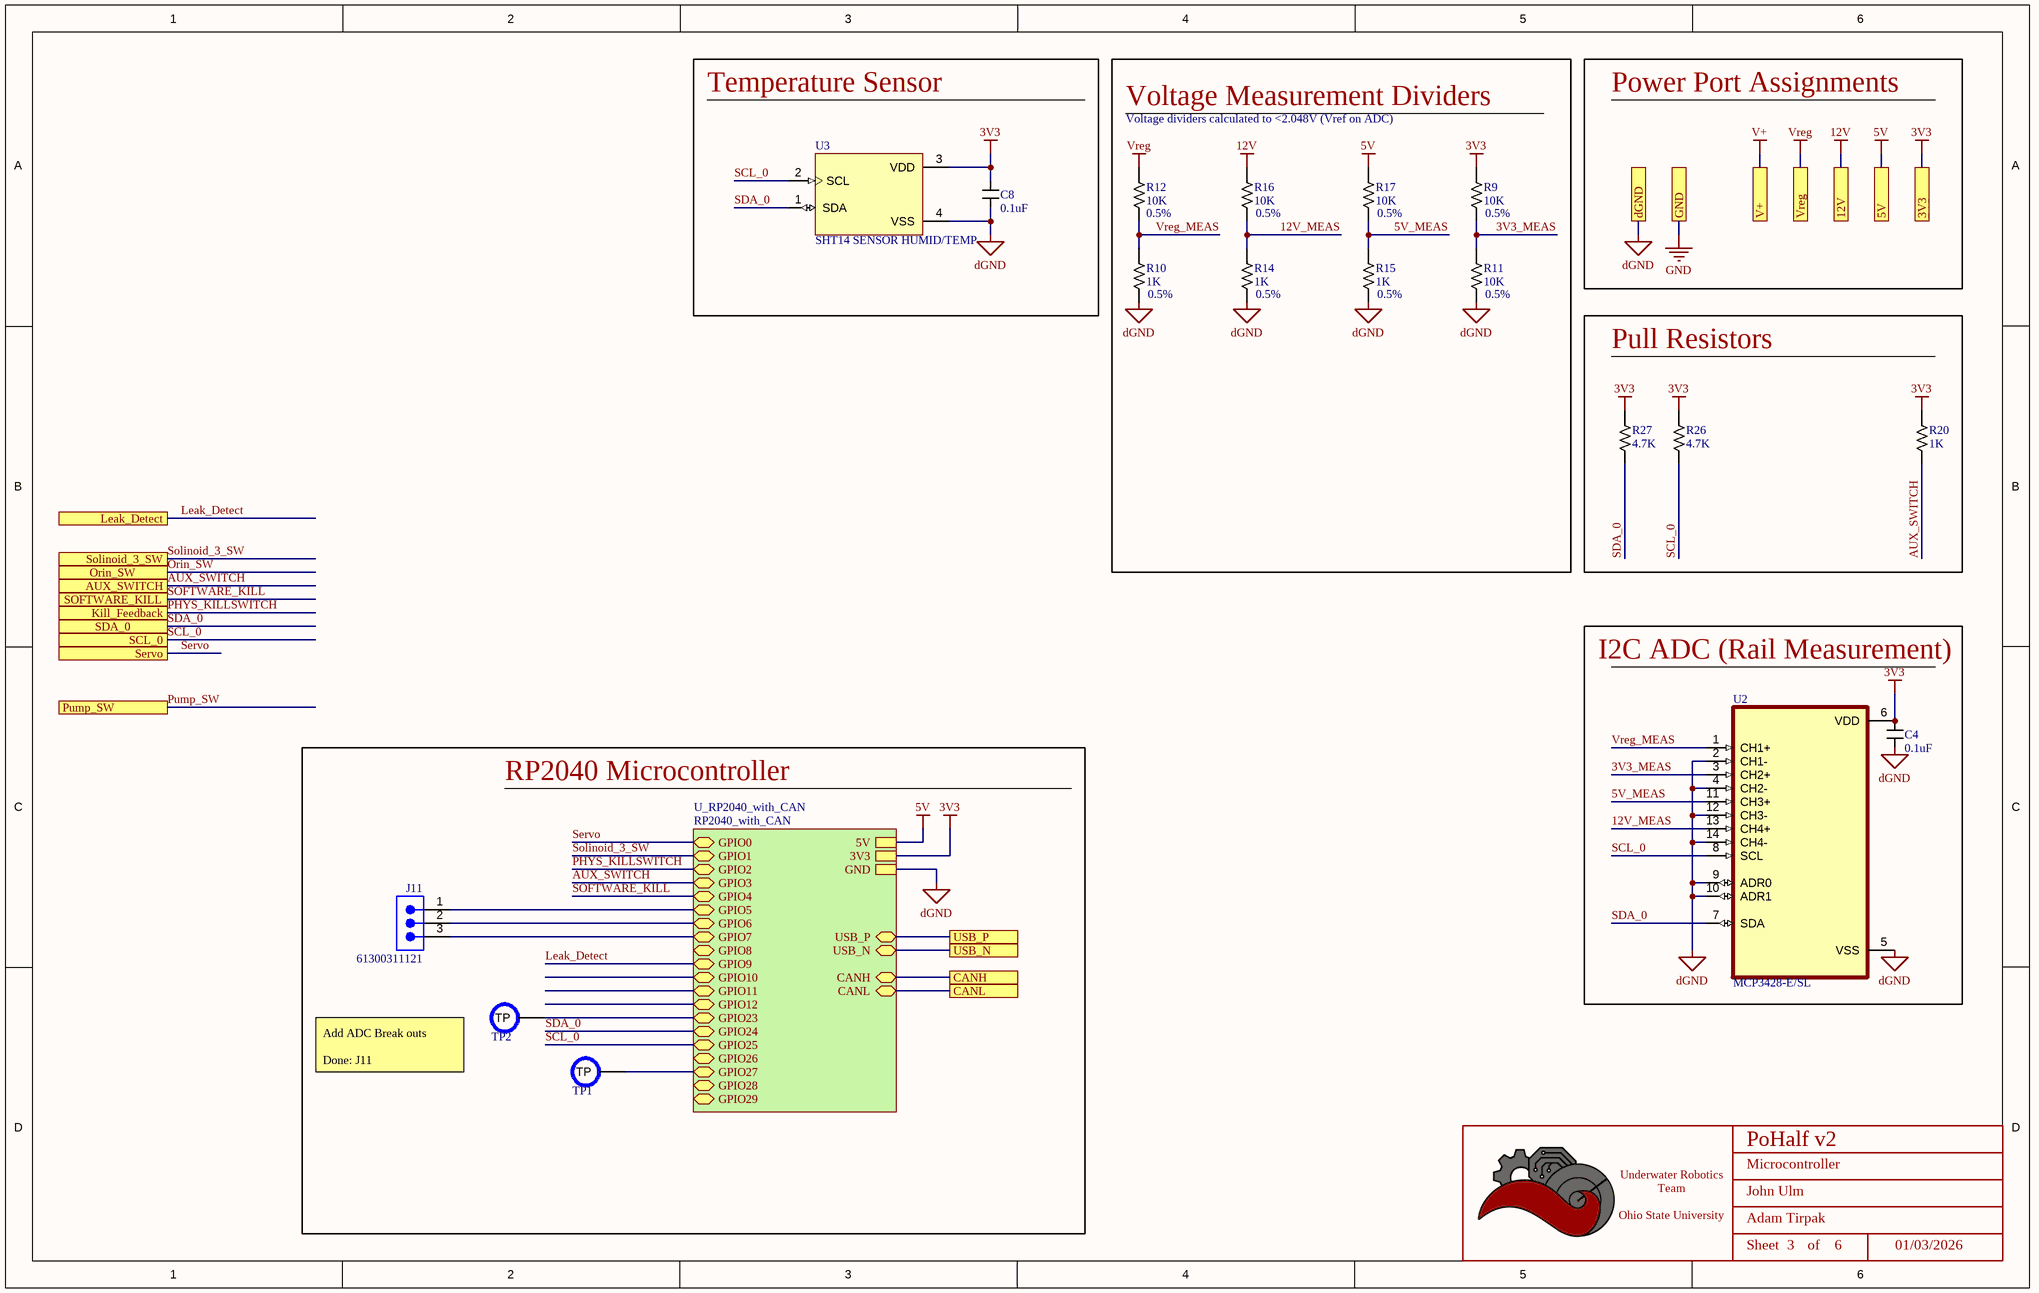
[diagram p2: Microcontroller.SchDoc]

### Parts
(Parts that share a designator on the sheet are numbered #1, #2 ... from top to bottom, then left to right.)
*#3  Title_Block  [LOGO]  (value not drawn)  (graphical)
C4  value 0.1uF  [CAPACITOR_0603]  (hidden comment: 100nF Ceramic 6.3V)
C8  value 0.1uF  [CAPACITOR_0603]  (hidden comment: 100nF Ceramic 6.3V)
J11  61300311121  [61300311121]
R9  Value  (Ohms): 10K  [RESISTOR_0603]  (hidden comment: 10k Ohm 0.5% 1/10W)
R10  Value  (Ohms): 1K  [RESISTOR_0603]  (hidden comment: 1k Ohm 5% 1/10W)
R11  Value  (Ohms): 10K  [RESISTOR_0603]  (hidden comment: 10k Ohm 0.5% 1/10W)
R12  Value  (Ohms): 10K  [RESISTOR_0603]  (hidden comment: 10k Ohm 0.5% 1/10W)
R14  Value  (Ohms): 1K  [RESISTOR_0603]  (hidden comment: 1k Ohm 5% 1/10W)
R15  Value  (Ohms): 1K  [RESISTOR_0603]  (hidden comment: 1k Ohm 5% 1/10W)
R16  Value  (Ohms): 10K  [RESISTOR_0603]  (hidden comment: 10k Ohm 0.5% 1/10W)
R17  Value  (Ohms): 10K  [RESISTOR_0603]  (hidden comment: 10k Ohm 0.5% 1/10W)
R20  Value  (Ohms): 1K  [RESISTOR_0603]  (hidden comment: 1k Ohm 5% 1/8W)
R26  Value  (Ohms): 4.7K  [RESISTOR_0603]  (hidden comment: 4.7k Ohm 5% 1/10W)
R27  Value  (Ohms): 4.7K  [RESISTOR_0603]  (hidden comment: 4.7k Ohm 5% 1/10W)
TP1  PCB Test Point  [TESTPOINT_1.2MM]  (value not drawn)  (no BOM)
TP2  PCB Test Point  [TESTPOINT_1.2MM]  (value not drawn)  (no BOM)
U2  MCP3428-E/SL  [SOIC127P600X175-14N]
U3  SHT14 SENSOR HUMID/TEMP  [XDCR_SHT41-AD1B-R2]

### Blocks framed on the sheet
Temperature Sensor: C8 U3
Pull Resistors: R20 R26 R27
I2C ADC (Rail Measurement): C4 U2
RP2040 Microcontroller: J11 TP1 TP2

### Sub-sheets
U_RP2040_with_CAN = RP2040_with_CAN (file not in this document): USB_P (bidir), USB_N (bidir), 5V, CANH (bidir), CANL (bidir), GPIO0 (bidir), GPIO1 (bidir), GPIO2 (bidir), GPIO3 (bidir), GPIO4 (bidir), GPIO5 (bidir), GPIO6 (bidir), GPIO7 (bidir), GPIO8 (bidir), GPIO9 (bidir), GPIO10 (bidir), GPIO11 (bidir), GPIO12 (bidir), GPIO23 (bidir), GPIO24 (bidir), GPIO25 (bidir), GPIO26 (bidir), GPIO27 (bidir), GPIO28 (bidir), GPIO29 (bidir), 3V3, GND

### Ports
3V3, 5V, 12V, AUX_SWITCH, CANH, CANL, dGND, GND, Kill_Feedback, Leak_Detect, Orin_SW, Pump_SW, SCL_0, SDA_0, Servo, SOFTWARE_KILL, Solinoid_3_SW, USB_N, USB_P, V+, Vreg

### Nets
3V3: C4.1 C8.1 R9.1 R20.1 R26.1 R27.1 U2.6(VDD) U3.3(VDD) ; port 3V3, sheet U_RP2040_with_CAN/3V3
5V: R17.1 ; port 5V, sheet U_RP2040_with_CAN/5V
12V: R16.1 ; port 12V
GND: C4.2 C8.2 R10.2 R11.2 R14.2 R15.2 U2.2(CH1-) U2.4(CH2-) U2.5(VSS) U2.9(ADR0) U2.10(ADR1) U2.12(CH3-) U2.14(CH4-) U3.4(VSS) ; port GND, port dGND, sheet U_RP2040_with_CAN/GND  [also labelled dGND]
Vreg: R12.1 ; port Vreg
3V3_MEAS: R9.2 R11.1 U2.3(CH2+)
5V_MEAS: R15.1 R17.2 U2.11(CH3+)
12V_MEAS: R14.1 R16.2 U2.13(CH4+)
AUX_SWITCH: R20.2 ; port AUX_SWITCH, sheet U_RP2040_with_CAN/GPIO3
CANH: port CANH, sheet U_RP2040_with_CAN/CANH
CANL: port CANL, sheet U_RP2040_with_CAN/CANL
Leak_Detect: port Leak_Detect, sheet U_RP2040_with_CAN/GPIO9
Orin_SW: port Orin_SW
PHYS_KILLSWITCH: port Kill_Feedback, sheet U_RP2040_with_CAN/GPIO2  [project net KILL_FEEDBACK]
Pump_SW: port Pump_SW
SCL_0: R26.2 U2.8(SCL) U3.2(SCL) ; port SCL_0, sheet U_RP2040_with_CAN/GPIO25
SDA_0: R27.2 U2.7(SDA) U3.1(SDA) ; port SDA_0, sheet U_RP2040_with_CAN/GPIO24
Servo: port Servo, sheet U_RP2040_with_CAN/GPIO0
SOFTWARE_KILL: port SOFTWARE_KILL, sheet U_RP2040_with_CAN/GPIO4
Solinoid_3_SW: port Solinoid_3_SW, sheet U_RP2040_with_CAN/GPIO1
USB_N: port USB_N, sheet U_RP2040_with_CAN/USB_N
USB_P: port USB_P, sheet U_RP2040_with_CAN/USB_P
Vreg_MEAS: R10.1 R12.2 U2.1(CH1+)
NetJ11_1: J11.1 ; sheet U_RP2040_with_CAN/GPIO5
NetJ11_2: J11.2 ; sheet U_RP2040_with_CAN/GPIO6
NetJ11_3: J11.3 ; sheet U_RP2040_with_CAN/GPIO7
NetTP1_TP: TP1.TP ; sheet U_RP2040_with_CAN/GPIO27
NetTP2_TP: TP2.TP ; sheet U_RP2040_with_CAN/GPIO23

### Notes on the sheet
- Power Port Assignments
- Voltage Measurement Dividers
- Voltage dividers calculated to <2.048V (Vref on ADC)
- (near R12) 0.5%
- (near R16) 0.5%
- (near R17) 0.5%
- (near R9) 0.5%
- (near R10) 0.5%
- (near R14) 0.5%
- (near R15) 0.5%
- (near R11) 0.5%
- Add ADC Break outs
  Done: J11
- DWG. NO.
- REV.
- SHT.
- THIS DOCUMENT AND THE DATA DISCLOSED HEREIN OR HEREWITH IS THE PROPERTY OF ALTIUM LIMITED AND MAY BE FREELY DISTRIBUTED IN WHOLE. NO RIGHTS ARE RESERVED OR EXPRESS OR IMPLIED WARANTEE GIVEN.
- REVISION
- DESCRIPTION
- DATE
- APPROVED
- ENG:
- APPROVALS
- PROJECT
- DSN:
- CHK:
- REFERENCE DOCUMENTS
- PROJECT REVISION:
- TITLE
- DOCUMENT REVISION:
- DESIGN ITEM:
- BOM:
- FAB DWG:
- PCB DWG:
- ASSY DWG:
- SCALE:
- SIZE
- B
- CAGE CODE
- FILE NAME
- DWG NO.
- SHEET
- OF
- REV
- (in symbol Title_Block) Underwater Robotics Team / Ohio State University; Sheet; of

### Library data of the parts
*#3 = Title_Block: as *#1 on sheet Connector
C4 C8 = CAPACITOR_0.1uF_0603: Cap 100nF 6.3V +/-10% / Ceramic 0603; Made By: Flip B; ComponentLink1Description: Datsheet; ComponentLink1URL: https://www.mouser.com/datasheet/2/212/KEM_C1002_X7R_SMD-1102033.pdf; Tolerance: +/- 10%; Voltage: 6.3V; Supplier 1: Digi-Key; Supplier Part Number 1: 399-15351-1-ND
J11 = CMP-1502-01062-4: THT Vertical Pin Header WR-PHD, Pitch 2.54 mm, Single Row, 3 pins; Connector Type: Male Pin; Number of Contacts: 3; Operating Supply Voltage: 250V; Current Rating: 3A; Pitch: 2.54mm; Contact Resistance: 20mΩ; Gender: Male; Height: 8.94mm; Color: Black; Min Operating Temperature: -40°C; Max Operating Temperature: 105°C; Mount: Through Hole; Termination: Solder; Number of Rows: 1; Packaging: Bulk; Number of Pins: 3; Lead Pitch: 2.54mm; RoHS: Compliant; Contact Plating: Gold; Number of Positions: 3; Lead Free: Lead Free; Voltage Rating: 250V; Contact Mating Length: 5.9944mm; Orientation: Vertical; Contact Material: Gold
R9 R11 R12 R16 R17 = RESISTOR_10K_0.5%_0603: RES 10k OHM 0.5% 1/10W 0603; Tolerance: +/- 0.5%; Made By: Robert Pafford; Wattage: 1/10W; Supplier: Digikey; Digikey Part Numer: CR0603-JW-104ELFTR-ND; Supplier 1: Digi-Key; Supplier Part Number 1: 749-1695-1-ND
R10 R14 R15 = RESISTOR_1K_0.5%_0603: RES 1k OHM 0.5% 1/10W 0603; Tolerance: +/- 0.5%; Made By: Robert Pafford; Wattage: 1/10W; Supplier: Digikey; Digikey Part Numer: CR0603-JW-104ELFTR-ND; Supplier 1: Digi-Key; Supplier Part Number 1: 749-1693-1-ND
R20 = RESISTOR_1K_0603: as R3 on sheet Connector; ComponentLink1Description: Datasheet; ComponentLink1URL: https://www.bourns.com/docs/product-datasheets/CRxxxxx.pdf; Wattage: 1/8W; Supplier: Digikey; Digikey Part Numer: CR0603-JW-104ELFTR-ND; Supplier 1: Digi-Key; Supplier Part Number 1: 2019-RK73B1JTTD102JCT-ND
R26 R27 = RESISTOR_4.7K_0603: as R1 on sheet Connector; Wattage: 1/10W; Supplier: Digikey; Digikey Part Numer: CR0603-JW-104ELFTR-ND; Supplier 1: Digi-Key; Supplier Part Number 1: RMCF0603JT4K70CT-ND
TP1 TP2 = TESTPOINT: Made By: Robert Pafford
U2 = MCP3428-E/SL: 16 Bit Analog to Digital Converter 4 Input 1 Sigma-Delta 14-SOIC; MF: Microchip; Package: SOIC-14 Microchip; SnapEDA_Link: https://www.snapeda.com/parts/MCP3428-E/SL/Microchip/view-part/13249/?ref=snap; MP: MCP3428-E/SL; Price: None; Availability: Unavailable; Value: *; Supplier 1: Digikey; Supplier Part Number 1: MCP3428-E/SL-ND
U3 = SHT41-AD1B-R2: Digital Relative Humidity Temperature Sensor, Â±1.8 / max 2.5 %RH, Â±0.2 Â°C, Ultra-Low-Power; MF: Sensirion; Price: None; SnapEDA_Link: https://www.snapeda.com/parts/SHT41-AD1B-R2/Sensirion/view-part/?ref=snap; MP: SHT41-AD1B-R2; Purchase-URL: https://pricing.snapeda.com/search/part/SHT41-AD1B-R2/?ref=eda; Value: *; Availability: In Stock; Package: None; Check_prices: https://www.snapeda.com/parts/SHT41-AD1B-R2/Sensirion/view-part/?ref=eda; Supplier 1: Digi-Key; Supplier Part Number 1: 1649-SHT41-AD1B-R2CT-ND

## Sheet Kill_Switch.SchDoc: Kill Switch
size B; Date: 01/03/2026; Author: John Ulm; Organization: ORGANIZATION; Address1: ADDRESS 1; Address2: ADDRESS 2; Address3: ADDRESS 3; Address4: ADDRESS 4; Revision: -; SheetNumber: 2; SheetTotal: 6; ENG_APP_DATE: --/--/--; DSN_APP_DATE: --/--/--; CHK_APP_DATE: --/--/--
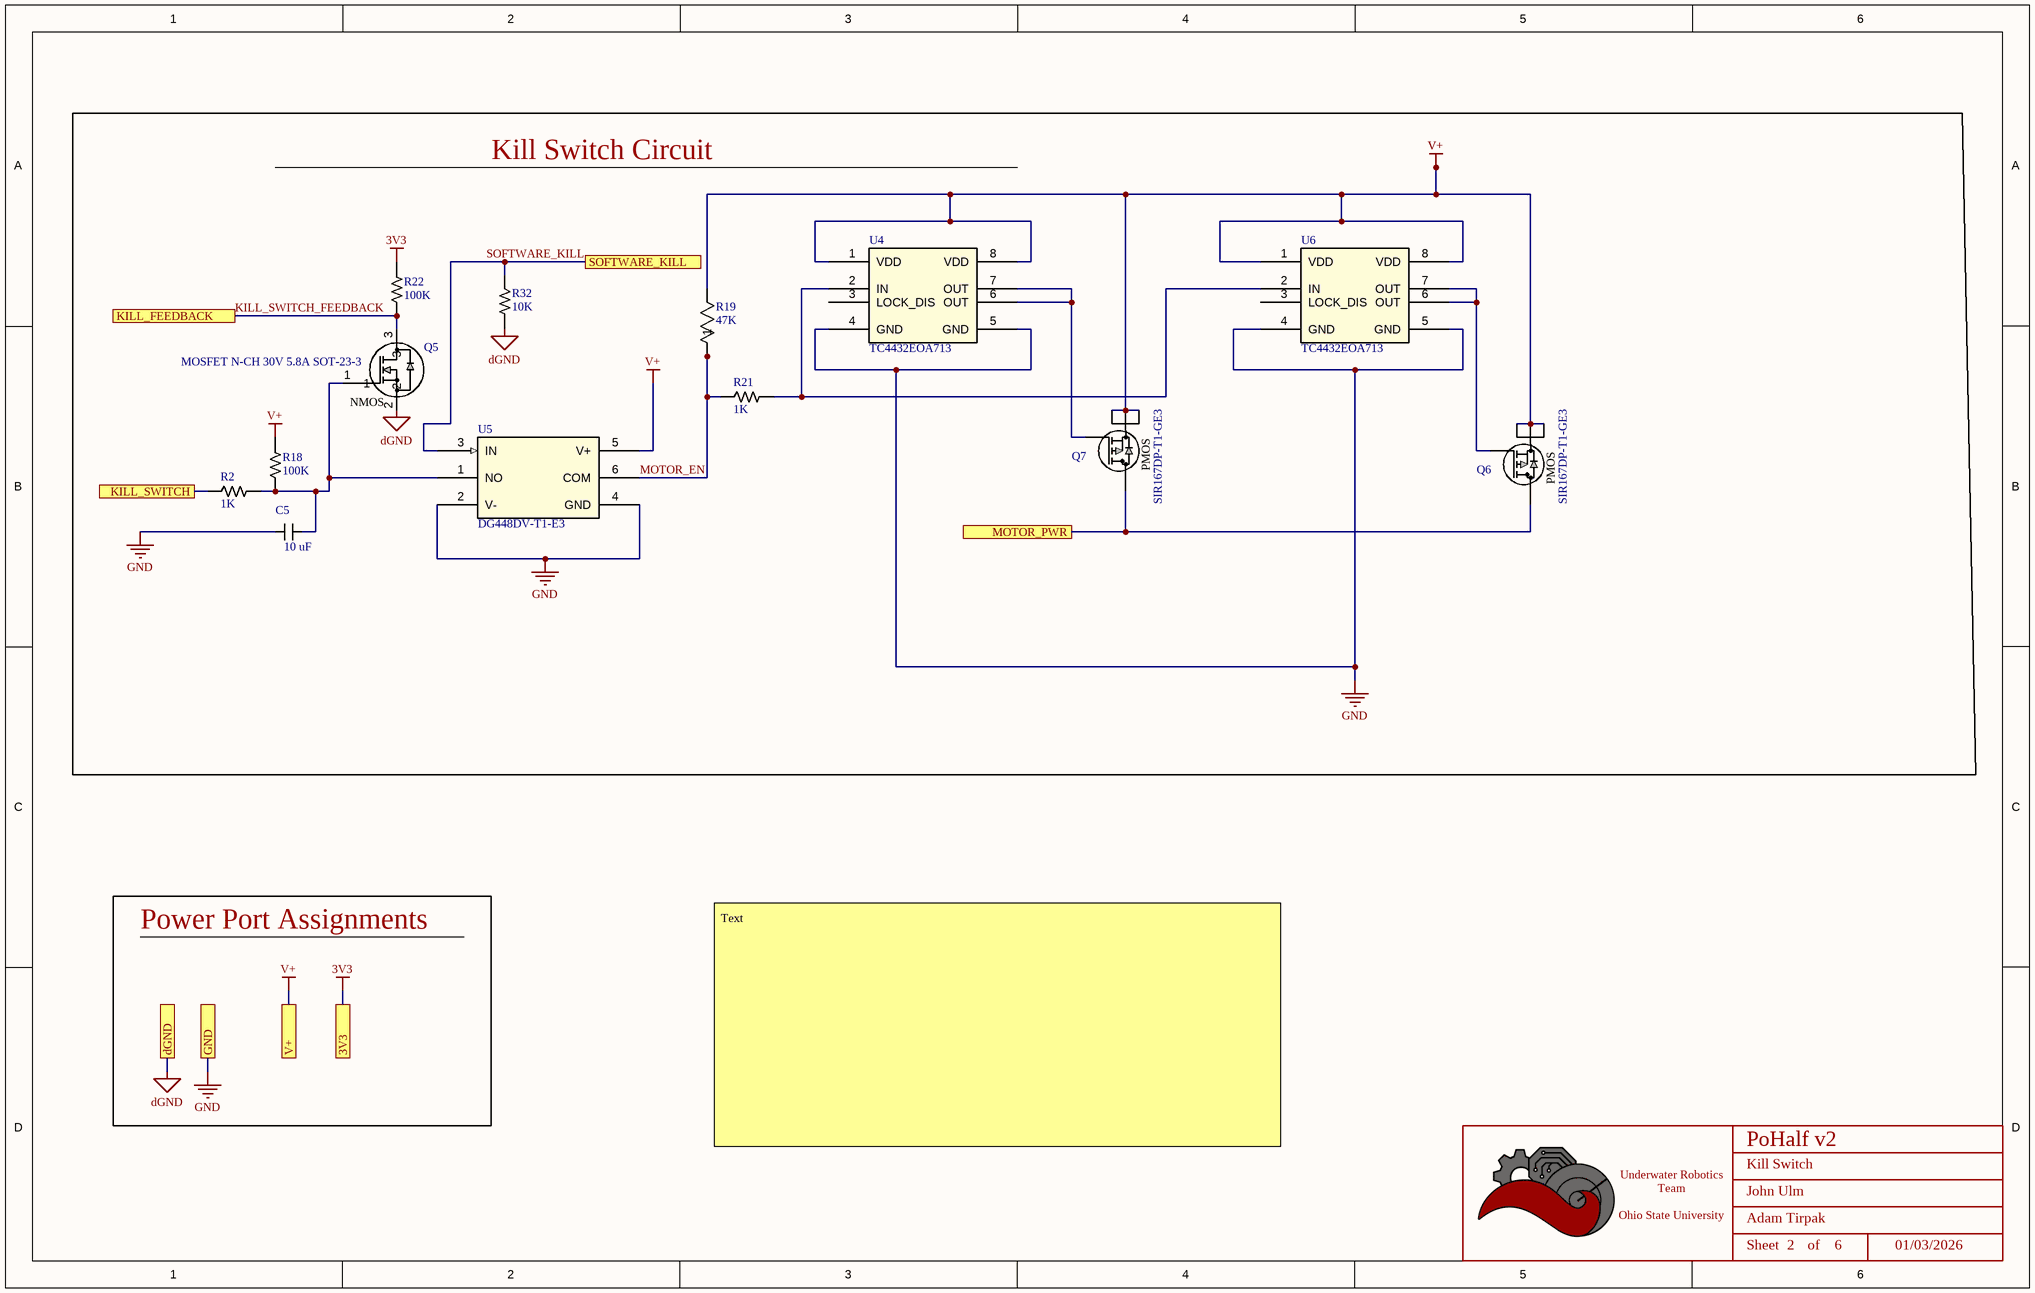
[diagram p3: Kill_Switch.SchDoc]

### Parts
(Parts that share a designator on the sheet are numbered #1, #2 ... from top to bottom, then left to right.)
*#4  Title_Block  [LOGO]  (value not drawn)  (graphical)
C5  Value (uF): 10 uF  [CAPACITOR_1206]  (hidden comment: 10uF Ceramic 25V)
Q5  MOSFET N-CH 30V 5.8A SOT-23-3  [SOT-23-3]
Q6  SIR167DP-T1-GE3  [MOSFET_7DP-T1-GE3_VIS]
Q7  SIR167DP-T1-GE3  [MOSFET_7DP-T1-GE3_VIS]
R2  Value  (Ohms): 1K  [RESISTOR_0603]  (hidden comment: 1k Ohm 5% 1/8W)
R18  Value  (Ohms): 100K  [RESISTOR_0603]  (hidden comment: 100k Ohm 0.5% 1/10W)
R19  47K  [CAPACITOR_0603]
R21  Value  (Ohms): 1K  [RESISTOR_0402]  (hidden comment: 1k Ohm 1% 1/16W)
R22  Value  (Ohms): 100K  [RESISTOR_0603]  (hidden comment: 100k Ohm 0.5% 1/10W)
R32  Value  (Ohms): 10K  [RESISTOR_0603]  (hidden comment: 10k Ohm 5% 1/10W)
U4  TC4432EOA713  [SOIC8-N_MC_MCH]
U5  DG448DV-T1-E3  [TSOP6_DG_VIS-M]
U6  TC4432EOA713  [SOIC8-N_MC_MCH]

### Blocks framed on the sheet
Kill Switch Circuit: C5 Q5-Q7 R2 R18 R19 R21 R22 R32 U4-U6

### Ports
3V3, dGND, GND, KILL_FEEDBACK, KILL_SWITCH, MOTOR_PWR, SOFTWARE_KILL, V+

### Nets
3V3: R22.1 ; port 3V3
GND: C5.2 Q5.2 R32.1 U4.4(GND) U4.5(GND) U5.2(V-) U5.4(GND) U6.4(GND) U6.5(GND) ; port GND, port dGND  [also labelled dGND]
MOTOR_PWR: Q6.D Q7.D ; port MOTOR_PWR
V+: Q6.1(S) Q6.2(S) Q6.3(S) Q7.1(S) Q7.2(S) Q7.3(S) R18.1 R19.2 U4.1(VDD) U4.8(VDD) U5.5(V+) U6.1(VDD) U6.8(VDD) ; port V+
KILL_SWITCH: R2.2 ; port KILL_SWITCH
KILL_SWITCH_FEEDBACK: Q5.3 R22.2 ; port KILL_FEEDBACK  [project net KILL_FEEDBACK]
MOTOR_EN: R19.1 R21.2 U5.6(COM)
SOFTWARE_KILL: R32.2 U5.3(IN) ; port SOFTWARE_KILL
NetC5_1: C5.1 Q5.1 R2.1 R18.2 U5.1(NO)
NetQ6_4: Q6.4(G) U6.6(OUT) U6.7(OUT)
NetQ7_4: Q7.4(G) U4.6(OUT) U4.7(OUT)
NetR21_1: R21.1 U4.2(IN) U6.2(IN)

Not connected (* = marked no-connect by the designer): U4 3(LOCK_DIS); U6 3(LOCK_DIS)

### Notes on the sheet
- Power Port Assignments
- Text
- DWG. NO.
- REV.
- SHT.
- THIS DOCUMENT AND THE DATA DISCLOSED HEREIN OR HEREWITH IS THE PROPERTY OF ALTIUM LIMITED AND MAY BE FREELY DISTRIBUTED IN WHOLE. NO RIGHTS ARE RESERVED OR EXPRESS OR IMPLIED WARANTEE GIVEN.
- REVISION
- DESCRIPTION
- DATE
- APPROVED
- ENG:
- APPROVALS
- PROJECT
- DSN:
- CHK:
- REFERENCE DOCUMENTS
- PROJECT REVISION:
- TITLE
- DOCUMENT REVISION:
- DESIGN ITEM:
- BOM:
- FAB DWG:
- PCB DWG:
- ASSY DWG:
- SCALE:
- SIZE
- B
- CAGE CODE
- FILE NAME
- DWG NO.
- SHEET
- OF
- REV
- (in symbol AO3404A) NMOS
- (in symbol SIR167DP-T1-GE3) PMOS
- (in symbol Title_Block) Underwater Robotics Team / Ohio State University; Sheet; of

### Library data of the parts
*#4 = Title_Block: as *#1 on sheet Connector
C5 = CAPACITOR_10uF_1206: Cap 10uF 25V +/-10% / Ceramic 1206; Made By: Robert Pafford; Tolerance: +/- 10%; Voltage: 25V; Supplier 1: Digi-Key; Supplier Part Number 1: 1276-1804-6-ND
Q5 = AO3404A: N-Channel 30 V 5.8A (Ta) 1.4W (Ta) Surface Mount SOT-23-3; Vendor: Alpha & Omega Semiconductor Inc.; SourceLibrary: ON_Semiconductor_2020-01-13; Vgs (Max): 3V @ 5.8A, 10V; Vgs (th): 3V @ 250µA; Rds (on): 28mOhm @ 5.8A, 10V; Amp Rating: 5.8 A; FET Type: N-Channel; Package: SOT23-3L; Manufacturer _Part_Number: AO3404A; Vdss: 30V; Power Dissipation: 1.4W (Ta); Supplier 1: Digi-Key; Supplier Part Number 1: 785-1004-1-ND; Created By: Dylan T
Q6 Q7 = SIR167DP-T1-GE3: as Q1 on sheet Connector; Copyright: Copyright (C) 2022 Ultra Librarian. All rights reserved.; Manufacturer_Part_Number: SIR167DP-T1-GE3; RefDes: RefDes; Supplier 1: Mouser; Supplier Part Number 1: 78-SIR167DP-T1-GE3
R2 = RESISTOR_1K_0603: as R3 on sheet Connector; ComponentLink1Description: Datasheet; ComponentLink1URL: https://www.bourns.com/docs/product-datasheets/CRxxxxx.pdf; Wattage: 1/8W; Supplier: Digikey; Digikey Part Numer: CR0603-JW-104ELFTR-ND; Supplier 1: Digi-Key; Supplier Part Number 1: 2019-RK73B1JTTD102JCT-ND
R18 R22 = RESISTOR_100K_0.5%_0603: RES 100k OHM 0.5% 1/10W 0603; Tolerance: +/- 0.5%; Made By: John Ulm; ComponentLink1Description: Datasheet; ComponentLink1URL: https://www.bourns.com/docs/product-datasheets/CRxxxxx.pdf; Wattage: 1/10W; Supplier: Digikey; Digikey Part Numer: CR0603-JW-104ELFTR-ND; Supplier 1: Digi-Key; Supplier Part Number 1: 311-2395-1-ND
R19 = RC0603JR-1347KL: 47kohm 0603 1/10w; Mfr_Name: Yageo; Copyright: Copyright (C) 2024 Ultra Librarian. All rights reserved.; Manufacturer_Part_Number: RC0603JR-1347KL; RefDes: RefDes; Type: DEV; Supplier 1: Mouser; Supplier Part Number 1: 667-ERJ-3GEYJ473V
R21 = RESISTOR_1K_0402: RES 1k OHM 1% 1/16W 0402; Tolerance: +/- 1%; Made By: Robert Pafford; Wattage: 1/16W; Supplier: Digikey; Digikey Part Numer: CR0603-JW-104ELFTR-ND; Supplier 1: Digi-Key; Supplier Part Number 1: 13-AC0402FR-131KLCT-ND
R32 = RESISTOR_10K_0603: as R4 on sheet Connector; ComponentLink1Description: Datasheet; ComponentLink1URL: https://www.bourns.com/docs/product-datasheets/CRxxxxx.pdf; Supplier: Digikey; Digikey Part Numer: CR0603-JW-104ELFTR-ND; Supplier 1: Digi-Key; Supplier Part Number 1: 2019-RK73B1JTTD103JCT-ND
U4 U6 = TC4432EOA713: High-Side or Low-Side Gate Driver IC Non-Inverting 8-SOIC; Mfr_Name: Microchip; Copyright: Copyright (C) 2024 Ultra Librarian. All rights reserved.; Manufacturer_Part_Number: TC4432EOA713; RefDes: RefDes; Type: DEV; Supplier 1: Digikey; Supplier Part Number 1: TC4432EOA713CT-ND
U5 = DG448DV-T1-E3: IC SWITCH SPST-NOX1 25OHM 6TSOP; Mfr_Name: Vishay; Copyright: Copyright (C) 2024 Ultra Librarian. All rights reserved.; Manufacturer_Part_Number: DG448DV-T1-E3; RefDes: RefDes; Type: DEV; Supplier 1: Mouser; Supplier Part Number 1: 781-DG448DV-E3

## Nets that join several sheets
3V3: Connector (5 pins), Power (C11.1 U7.2 U7.4), Microcontroller (8 pins), Kill_Switch (R22.1)
5V: Connector (F3.1 J4.1 R6.1 R13.1), Power (6 pins), Microcontroller (R17.1)
12V: Connector (12 pins), Power (C2.1 C3.1 PS1.7 PS1.8), Microcontroller (R16.1)
GND: Connector (36 pins), Power (17 pins), Microcontroller (14 pins), Kill_Switch (9 pins)
MOTOR_PWR: Connector (J6.1 J7.1 R25.1), Kill_Switch (Q6.D Q7.D)
V+: Connector (J5.1 J5.2 R23.1), Power (U1.1 U1.3), Kill_Switch (13 pins)
Vreg: Connector (F1.1 R8.1), Power (5 pins), Microcontroller (R12.1)
AUX_SWITCH: Connector (J3.3), Microcontroller (R20.2)
KILL_SWITCH: Connector (J3.4), Kill_Switch (R2.2)
SCL_0: Connector (J4.2), Microcontroller (R26.2 U2.8 U3.2)
SDA_0: Connector (J4.3), Microcontroller (R27.2 U2.7 U3.1)